# Altium schematic sheet PowerSection.SchDoc: Power Section
size 420 x 297 mm; SheetNumber: 3
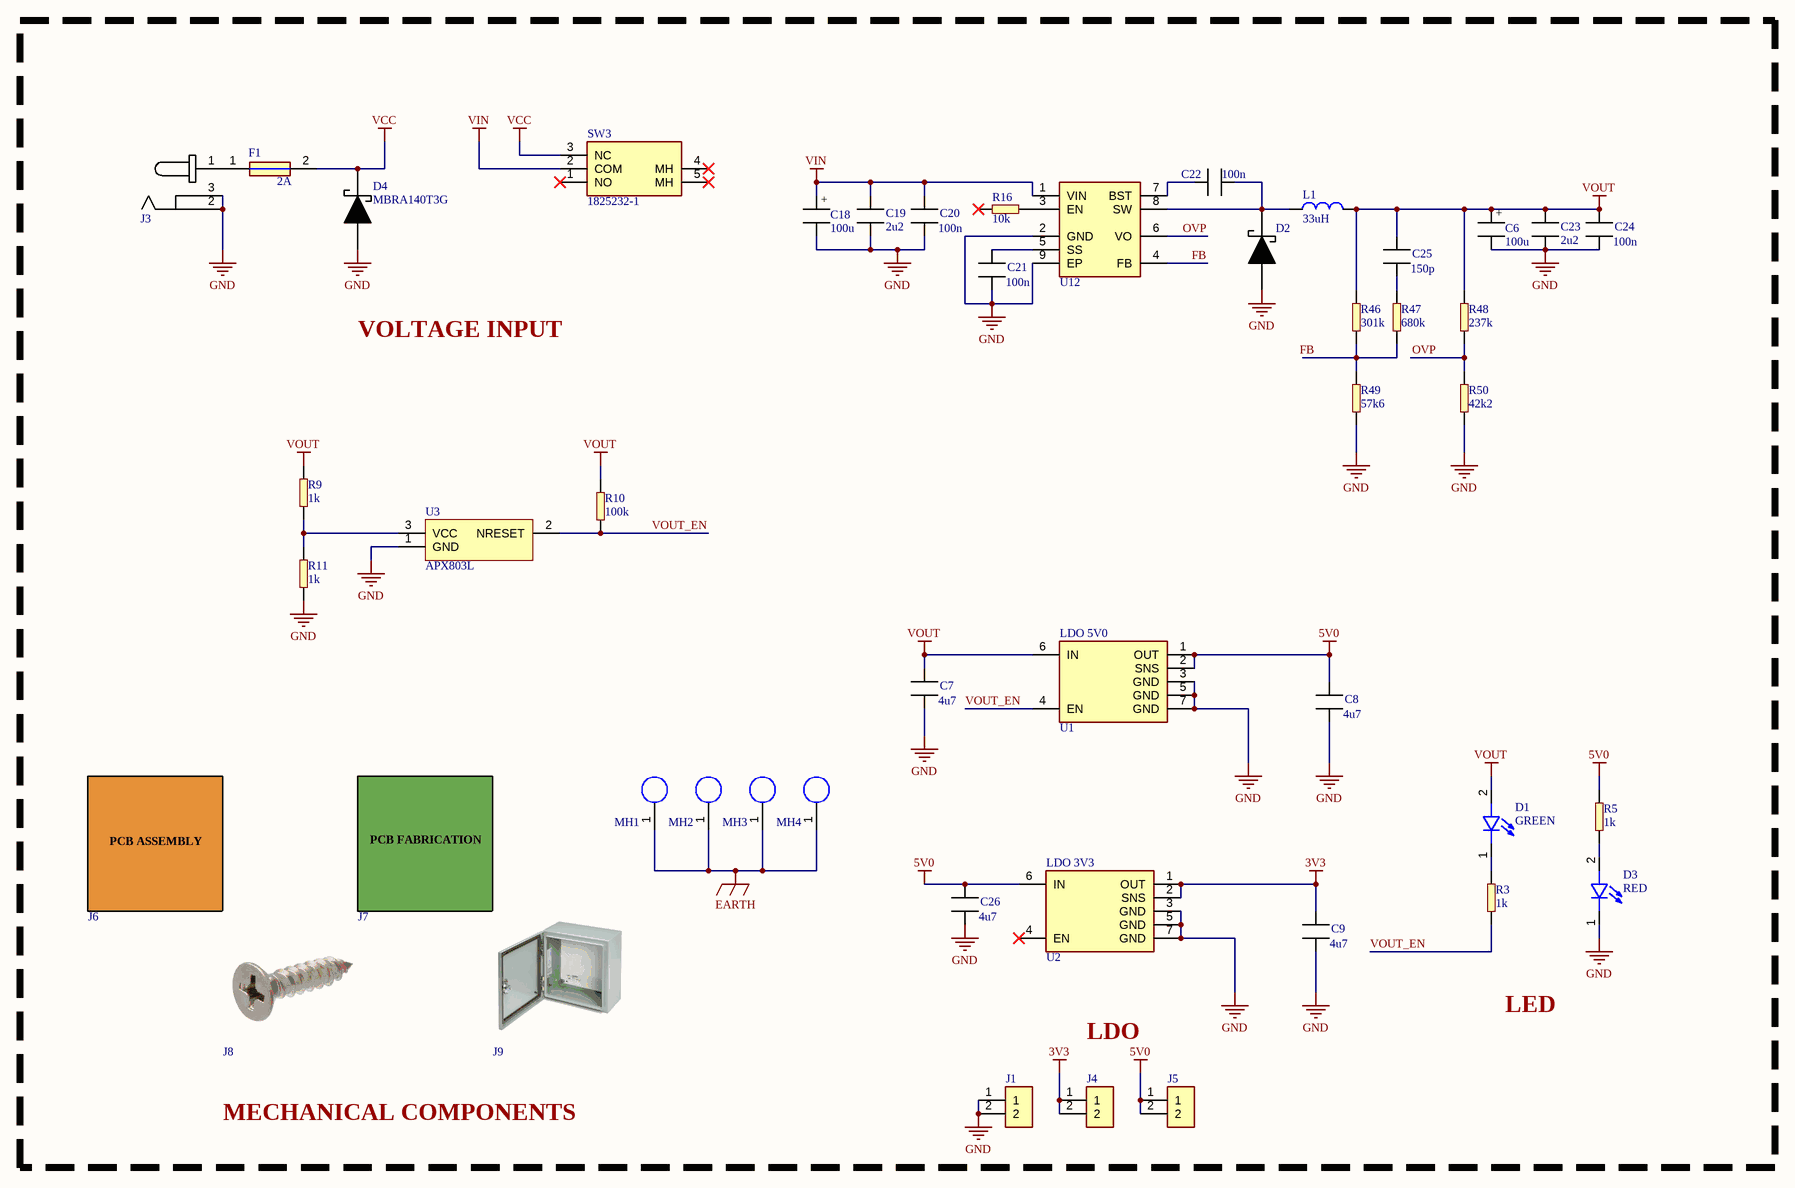
[diagram p0: PowerSection.SchDoc]

## Parts
C6  value 100u  [CAP_12.5_14]  (hidden comment: CAP_12.5_14)
C7  value 4u7  [CAPC1608X10N]  (hidden comment: ERP_102-1)
C8  value 4u7  [CAPC1608X10N]  (hidden comment: ERP_102-1)
C9  value 4u7  [CAPC1608X10N]  (hidden comment: ERP_102-1)
C18  value 100u  [CAP_12.5_14]  (hidden comment: CAP_12.5_14)
C19  value 2u2  [CAPC1608X10N]  (hidden comment: ERP_102-1)
C20  value 100n  [CAPC1608X10N]  (hidden comment: ERP_102-1)
C21  value 100n  [CAPC1608X10N]  (hidden comment: ERP_102-1)
C22  value 100n  [CAPC1608X10N]  (hidden comment: ERP_102-1)
C23  value 2u2  [CAPC1608X10N]  (hidden comment: ERP_102-1)
C24  value 100n  [CAPC1608X10N]  (hidden comment: ERP_102-1)
C25  value 150p  [CAPC1608X10N]  (hidden comment: ERP_102-1)
C26  value 4u7  [CAPC1608X10N]  (hidden comment: ERP_102-1)
D1  value GREEN  [LED_2SMD]  (hidden comment: LED_2SMD)
D2  ERP_104-3  [B560C-13-F]  (value not drawn)
D3  value RED  [LED_2SMD]  (hidden comment: LED_2SMD)
D4  value MBRA140T3G  [SS14_SMA]  (hidden comment: ERP_104-3)  (graphical)
F1  value 2A  [0679L]  (hidden comment: 0679L)
J1  ERP_148-2  [2PX1R]  (value not drawn)  (no BOM)
J3  KLDX-0202-AC  [KLDX-0202-AC]  (value not drawn)
J4  ERP_148-2  [2PX1R]  (value not drawn)  (no BOM)
J5  ERP_148-2  [2PX1R]  (value not drawn)  (no BOM)
J6  APCB  (value not drawn)  (graphical)
J7  BPCB  (value not drawn)  (graphical)
J8  SCREW  (value not drawn)  (graphical)
J9  ENCLOSURE  (value not drawn)  (graphical)
L1  value 33uH  [IND_1212]  (hidden comment: ERP_103-3)
MH1  MountingHole4X6  [MountingHole4X6]  (value not drawn)  (graphical)
MH2  MountingHole4X6  [MountingHole4X6]  (value not drawn)  (graphical)
MH3  MountingHole4X6  [MountingHole4X6]  (value not drawn)  (graphical)
MH4  MountingHole4X6  [MountingHole4X6]  (value not drawn)  (graphical)
R3  value 1k  [RES_0603]  (hidden comment: ERP_101-1)
R5  value 1k  [RES_0603]  (hidden comment: ERP_101-1)
R9  value 1k  [RES_0603]  (hidden comment: ERP_101-1)
R10  value 100k  [RES_0603]  (hidden comment: ERP_101-1)
R11  value 1k  [RES_0603]  (hidden comment: ERP_101-1)
R16  value 10k  [RES_0603]  (hidden comment: ERP_101-1)  (no BOM)
R46  value 301k  [RES_0603]  (hidden comment: ERP_101-1)
R47  value 680k  [RES_0603]  (hidden comment: ERP_101-1)
R48  value 237k  [RES_0603]  (hidden comment: ERP_101-1)
R49  value 57k6  [RES_0603]  (hidden comment: ERP_101-1)
R50  value 42k2  [RES_0603]  (hidden comment: ERP_101-1)
SW3  value 1825232-1  [3PIN_SPDT_TH_RA]  (hidden comment: ERP_110-4)
U1  value LDO 5V0  [TLV767XXDRV]  (hidden comment: TLV767XXDRV)
U2  value LDO 3V3  [TLV767XXDRV]  (hidden comment: TLV767XXDRV)
U3  APX803L  [APX803L]
U12  MP24943DN  [MP24943DN]  (value not drawn)

## Nets
3V3: C9.1 J4.1 J4.2 U2.1(OUT) U2.2(SNS)
5V0: C8.1 C26.1 J5.1 J5.2 R5.1 U1.1(OUT) U1.2(SNS) U2.6(IN)
EARTH: MH1.1 MH2.1 MH3.1 MH4.1
GND: C6.2 C7.2 C8.2 C9.2 C18.2 C19.1 C20.2 C21.2 C23.1 C24.2 C26.2 D2.2(A) D3.1 D4.2(A) J1.1 J1.2 J3.2 J3.3 R11.1 R49.1 R50.1 U1.3(GND) U1.5(GND) U1.7(GND) U2.3(GND) U2.5(GND) U2.7(GND) U3.1(GND) U12.2(GND) U12.9(EP)
VCC: D4.1(C) F1.2 SW3.3(NC)
VIN: C18.1 C19.2 C20.1 SW3.2(COM) U12.1(VIN)
VOUT: C6.1 C7.1 C23.2 C24.1 C25.1 D1.2 L1.2 R9.2 R10.2 R46.2 R48.2 U1.6(IN)
FB: R46.1 R47.1 R49.2 U12.4(FB)
OVP: R48.1 R50.2 U12.6(VO)
VOUT_EN: R3.1 R10.1 U1.4(EN) U3.2(NRESET)
NetC21_1: C21.1 U12.5(SS)
NetC22_1: C22.1 U12.7(BST)
NetC22_2: C22.2 D2.1(C) L1.1 U12.8(SW)
NetC25_2: C25.2 R47.2
NetD1_1: D1.1 R3.2
NetD3_2: D3.2 R5.2
NetF1_1: F1.1 J3.1
NetR9_1: R9.1 R11.2 U3.3(VCC)
NetR16_1: R16.1 U12.3(EN)

Not connected (* = marked no-connect by the designer): R16 2*; SW3 1(NO)* 4(MH)* 5(MH)*; U2 4(EN)*

## Notes on the sheet
- VOLTAGE INPUT
- LDO
- LED
- MECHANICAL COMPONENTS
- PROJECT
- SIZE
- FILE NAME
- A3
- TITLE
- SHEET
- OF
- REV
- (in symbol APCB) PCB ASSEMBLY
- (in symbol BPCB) PCB FABRICATION
- (in symbol CAP_12.5_14) +

## Library data of the parts
C6 C18 = CAP_12.5_14: Electrolytic Capacitor SMD; Manufacturer 1: KEMET; Manufacturer Part Number 1: EDH107M100A9RAA
C7-C9 C26 = MLCC_0603: MLCC 0603; Manufacturer 1: Murata; Manufacturer Part Number 1: GRM188R6YA475KE15D; Package: 0603; Suuplier Part Number 1: *; ERP: *; Supplier 1: Digikey; Supplier Part Number 1: 490-7205-1-ND
C19 C23 = MLCC_0603: MLCC 0603; Manufacturer 1: Murata Electronics; Manufacturer Part Number 1: GRT188R61H225KE13D; Package: 0603; Suuplier Part Number 1: *; ERP: *; Supplier 1: Digikey; Supplier Part Number 1: 490-12332-1-ND
C20-C22 C24 C25 = MLCC_0603: Chip Capacitor, 2-Leads, Body 1.60x0.80mm, IPC Medium Density; Package: 0603; Manufacturer 1: *; Manufacturer Part Number 1: *; Supplier 1: *; Suuplier Part Number 1: *; ERP: *
D1 = LED_2SMD: LED GREEN CLEAR 1204 SMD R/A; Manufacturer Part Number 1: 155124VS73200; Manufacturer 1: Würth Elektronik; ERP: *; Suuplier Part Number 1: *; Supplier 1: Digikey; Package: 1204
D2 = B560C-13-F: Manufacturer 1: Diodes Incorporated; Manufacturer Part Number 1: *; Value: B560C-13-F
D3 = LED_2SMD: LED RED CLEAR 1204 SMD R/A; Manufacturer Part Number 1: 155124RS73200; Manufacturer 1: Würth Elektronik; ERP: *; Suuplier Part Number 1: *; Supplier 1: Digikey; Package: 1204
D4 = SS14_SMA: Manufacturer 1: ONSEMi; Supplier Part Number 1: *; Supplier  1: *; Package: SMA; Manufacturer Part Number 1: MBRA140T3G; ERP: *; Supplier 1: Digikey; Supplier Part Number 1: MBRA140T3GOSCT-ND
F1 = 0679L: FUSE BRD MNT 2SMD; Manufacturer Part Number 1: 0679L2000-05; Manufacturer 1: Bel Fuse Inc.
J1 J4 J5 = 2PX1R
J3 = KLDX-0202-AC: CONN PWR JACK 2X5.5MM KINKED PIN; Manufacturer 1: Kycon, Inc.; Value: NA; Manufacturer Part Number 1: KLDX-0202-AC
J6 = APCB: Assembled PCB; Value: *; Manufacturer 1: *; Manufacturer Part Number 1: *
J7 = BPCB: Bare PCB; Manufacturer Part Number 1: *; Manufacturer 1: *; Value: *
J8 = SCREW: Mounting Screw
J9 = ENCLOSURE: PCB Enclosure; Manufacturer Part Number 1: *; Manufacturer 1: *; Value: *
L1 = IND_1212: Manufacturer Part Number 1: 7447709330; Manufacturer 1: Würth Elektronik
R3 R5 R9 R11 = RES_0603: Manufacturer 1: YAGEO; Manufacturer Part Number 1: RC0603FR-071KL; Package: 0603; ERP: *
R10 = RES_0603: Manufacturer Part Number 1: RC0603FR-07100KL; Package: 0603; Manufacturer 1: *; Supplier 1: *; Supplier Part Number 1: *; ERP: *
R16 = RES_0603: Package: 0603; Manufacturer 1: *; Manufacturer Part Number 1: *; Supplier 1: *; Supplier Part Number 1: *; ERP: *
R46 = RES_0603: Manufacturer 1: YAGEO; Manufacturer Part Number 1: RC0603FR-07301KL; Package: 0603; Supplier 1: *; Supplier Part Number 1: *; ERP: *
R47 = RES_0603: Manufacturer 1: YAGEO; Manufacturer Part Number 1: RC0603FR-07680KL; Package: 0603; Supplier 1: *; Supplier Part Number 1: *; ERP: *
R48 = RES_0603: Manufacturer 1: YAGEO; Manufacturer Part Number 1: AC0603FR-07237KL; Package: 0603; Supplier 1: *; Supplier Part Number 1: *; ERP: *
R49 = RES_0603: Manufacturer 1: YAGEO; Manufacturer Part Number 1: RC0603FR-0757K6L; Package: 0603; Supplier 1: *; Supplier Part Number 1: *; ERP: *
R50 = RES_0603: Manufacturer 1: YAGEO; Manufacturer Part Number 1: RC0603FR-0742K2L; Package: 0603; Supplier 1: *; Supplier Part Number 1: *; ERP: *
SW3 = 3PIN_SPDT_TH_RA: Manufacturer 1: TE; ERP: *; Manufacturer Part Number 1: 1825232-1; Package: 6X6; Supplier 1: *; Supplier Part Number 1: *; Supplier 2: Digikey; Supplier Part Number 2: A107673-ND
U1 = TLV767XXDRV: IC REG LINEAR; Manufacturer Part Number 1: TLV76750DRVR; Manufacturer 1: Texas Instruments
U2 = TLV767XXDRV: IC REG LINEAR; Manufacturer Part Number 1: TLV76733DRVR; Manufacturer 1: Texas Instruments
U3 = APX803L: IC SUPERVISOR 1 CHANNEL SOT23; Manufacturer Part Number 1: APX803L20-35SA-7; Manufacturer 1: Diodes Incorporated; Value: APX803L
U12 = MP24943DN: IC REG BUCK ADJ 3A 8SOIC; Manufacturer 1: Monolithic Power Systems Inc.; Manufacturer Part Number 1: MP24943DN-LF-Z; Value: *